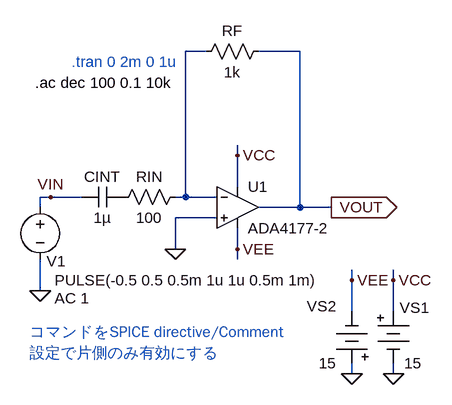
[diagram p0: schematic fig-01-03-27(c).asc]
fig-01-03-27(c).asc, the LTspice schematic file:
Version 4
SHEET 1 880 680
WIRE 160 -64 128 -64
WIRE 304 -64 240 -64
WIRE 208 96 208 80
WIRE 208 144 208 96
WIRE -80 160 -96 160
WIRE -32 160 -80 160
WIRE 128 160 128 -64
WIRE 128 160 112 160
WIRE 176 160 128 160
WIRE -96 176 -96 160
WIRE 304 176 304 -64
WIRE 304 176 240 176
WIRE 352 176 304 176
WIRE 176 192 112 192
WIRE 112 240 112 192
WIRE 208 240 208 208
WIRE 208 256 208 240
WIRE 384 288 384 272
WIRE 448 288 448 272
WIRE -96 304 -96 256
WIRE 384 336 384 288
WIRE 448 336 448 288
WIRE 384 432 384 416
WIRE 448 432 448 416
FLAG -96 304 0
FLAG -80 160 VIN
FLAG 384 432 0
FLAG 448 432 0
FLAG 384 288 VEE
FLAG 448 288 VCC
FLAG 208 96 VCC
FLAG 208 240 VEE
FLAG 352 176 VOUT
IOPIN 352 176 Out
FLAG 112 240 0
SYMBOL voltage -96 160 R0
WINDOW 0 10 99 Left 2
WINDOW 3 22 128 Left 2
WINDOW 123 22 156 Left 2
WINDOW 39 0 0 Left 0
SYMATTR InstName V1
SYMATTR Value PULSE(-0.5 0.5 0.5m 1u 1u 0.5m 1m)
SYMATTR Value2 AC 1
SYMBOL Misc\\battery 448 320 R0
WINDOW 0 10 10 Left 2
WINDOW 3 17 96 Left 2
SYMATTR InstName VS1
SYMATTR Value 15
SYMBOL Misc\\battery 384 432 R180
WINDOW 0 24 104 Left 2
WINDOW 3 24 16 Left 2
SYMATTR InstName VS2
SYMATTR Value 15
SYMBOL res 128 144 R90
WINDOW 0 0 56 VBottom 2
WINDOW 3 32 56 VTop 2
SYMATTR InstName RIN
SYMATTR Value 100
SYMBOL res 256 -80 R90
WINDOW 0 0 56 VBottom 2
WINDOW 3 32 56 VTop 2
SYMATTR InstName RF
SYMATTR Value 1k
SYMBOL cap 32 144 R90
WINDOW 0 0 32 VBottom 2
WINDOW 3 32 32 VTop 2
SYMATTR InstName CINT
SYMATTR Value 1µ
SYMBOL Opamps\\ADA4177-2 208 176 R0
SYMATTR InstName U1
TEXT -48 -48 Left 2 ;.tran 0 2m 0 1u
TEXT -104 -16 Left 2 !.ac dec 100 0.1 10k
TEXT -112 368 Left 2 ;コマンドをSPICE directive/Comment
TEXT -112 400 Left 2 ;設定で片側のみ有効にする

The netlist it stands for:
* fig-01-03-27(c).asc
V1 VIN 0 PULSE(-0.5 0.5 0.5m 1u 1u 0.5m 1m) AC 1
VS1 VCC 0 15
VS2 0 VEE 15
RIN N001 P001 100
RF VOUT N001 1k
CINT P001 VIN 1µ
* U1: ADA4177-2 (symbol Opamps\ADA4177-2 not available, pins judged from their places): In+=0 In-=N001 V+=VCC V-=VEE OUT=VOUT
* .tran 0 2m 0 1u
.ac dec 100 0.1 10k
* コマンドをSPICE directive/Comment
* 設定で片側のみ有効にする
.backanno
.end